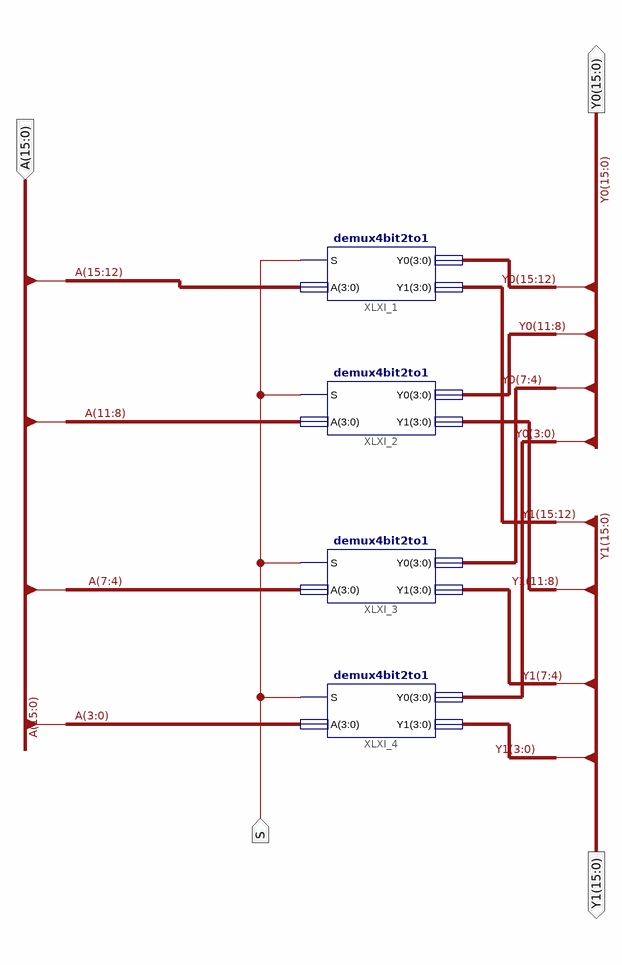
[diagram p0: schematic sheet 1]
// Xilinx ISE schematic demux16bit2to1.sch (spartan3e) as structural Verilog: 4 symbols, 4 ports
module demux16bit2to1 (
  input  [15:0] A,
  input  S,
  output [15:0] Y1,
  output [15:0] Y0
);

  demux4bit2to1 XLXI_1 (.A(A[15:12]), .S(S), .Y0(Y0[15:12]), .Y1(Y1[15:12]));
  demux4bit2to1 XLXI_2 (.A(A[11:8]), .S(S), .Y0(Y0[11:8]), .Y1(Y1[11:8]));
  demux4bit2to1 XLXI_3 (.A(A[7:4]), .S(S), .Y0(Y0[7:4]), .Y1(Y1[7:4]));
  demux4bit2to1 XLXI_4 (.A(A[3:0]), .S(S), .Y0(Y0[3:0]), .Y1(Y1[3:0]));
endmodule
